# Altium schematic sheet RadationTestBoardMCU.SchDoc
size B; SheetNumber: 12; SheetTotal: 14
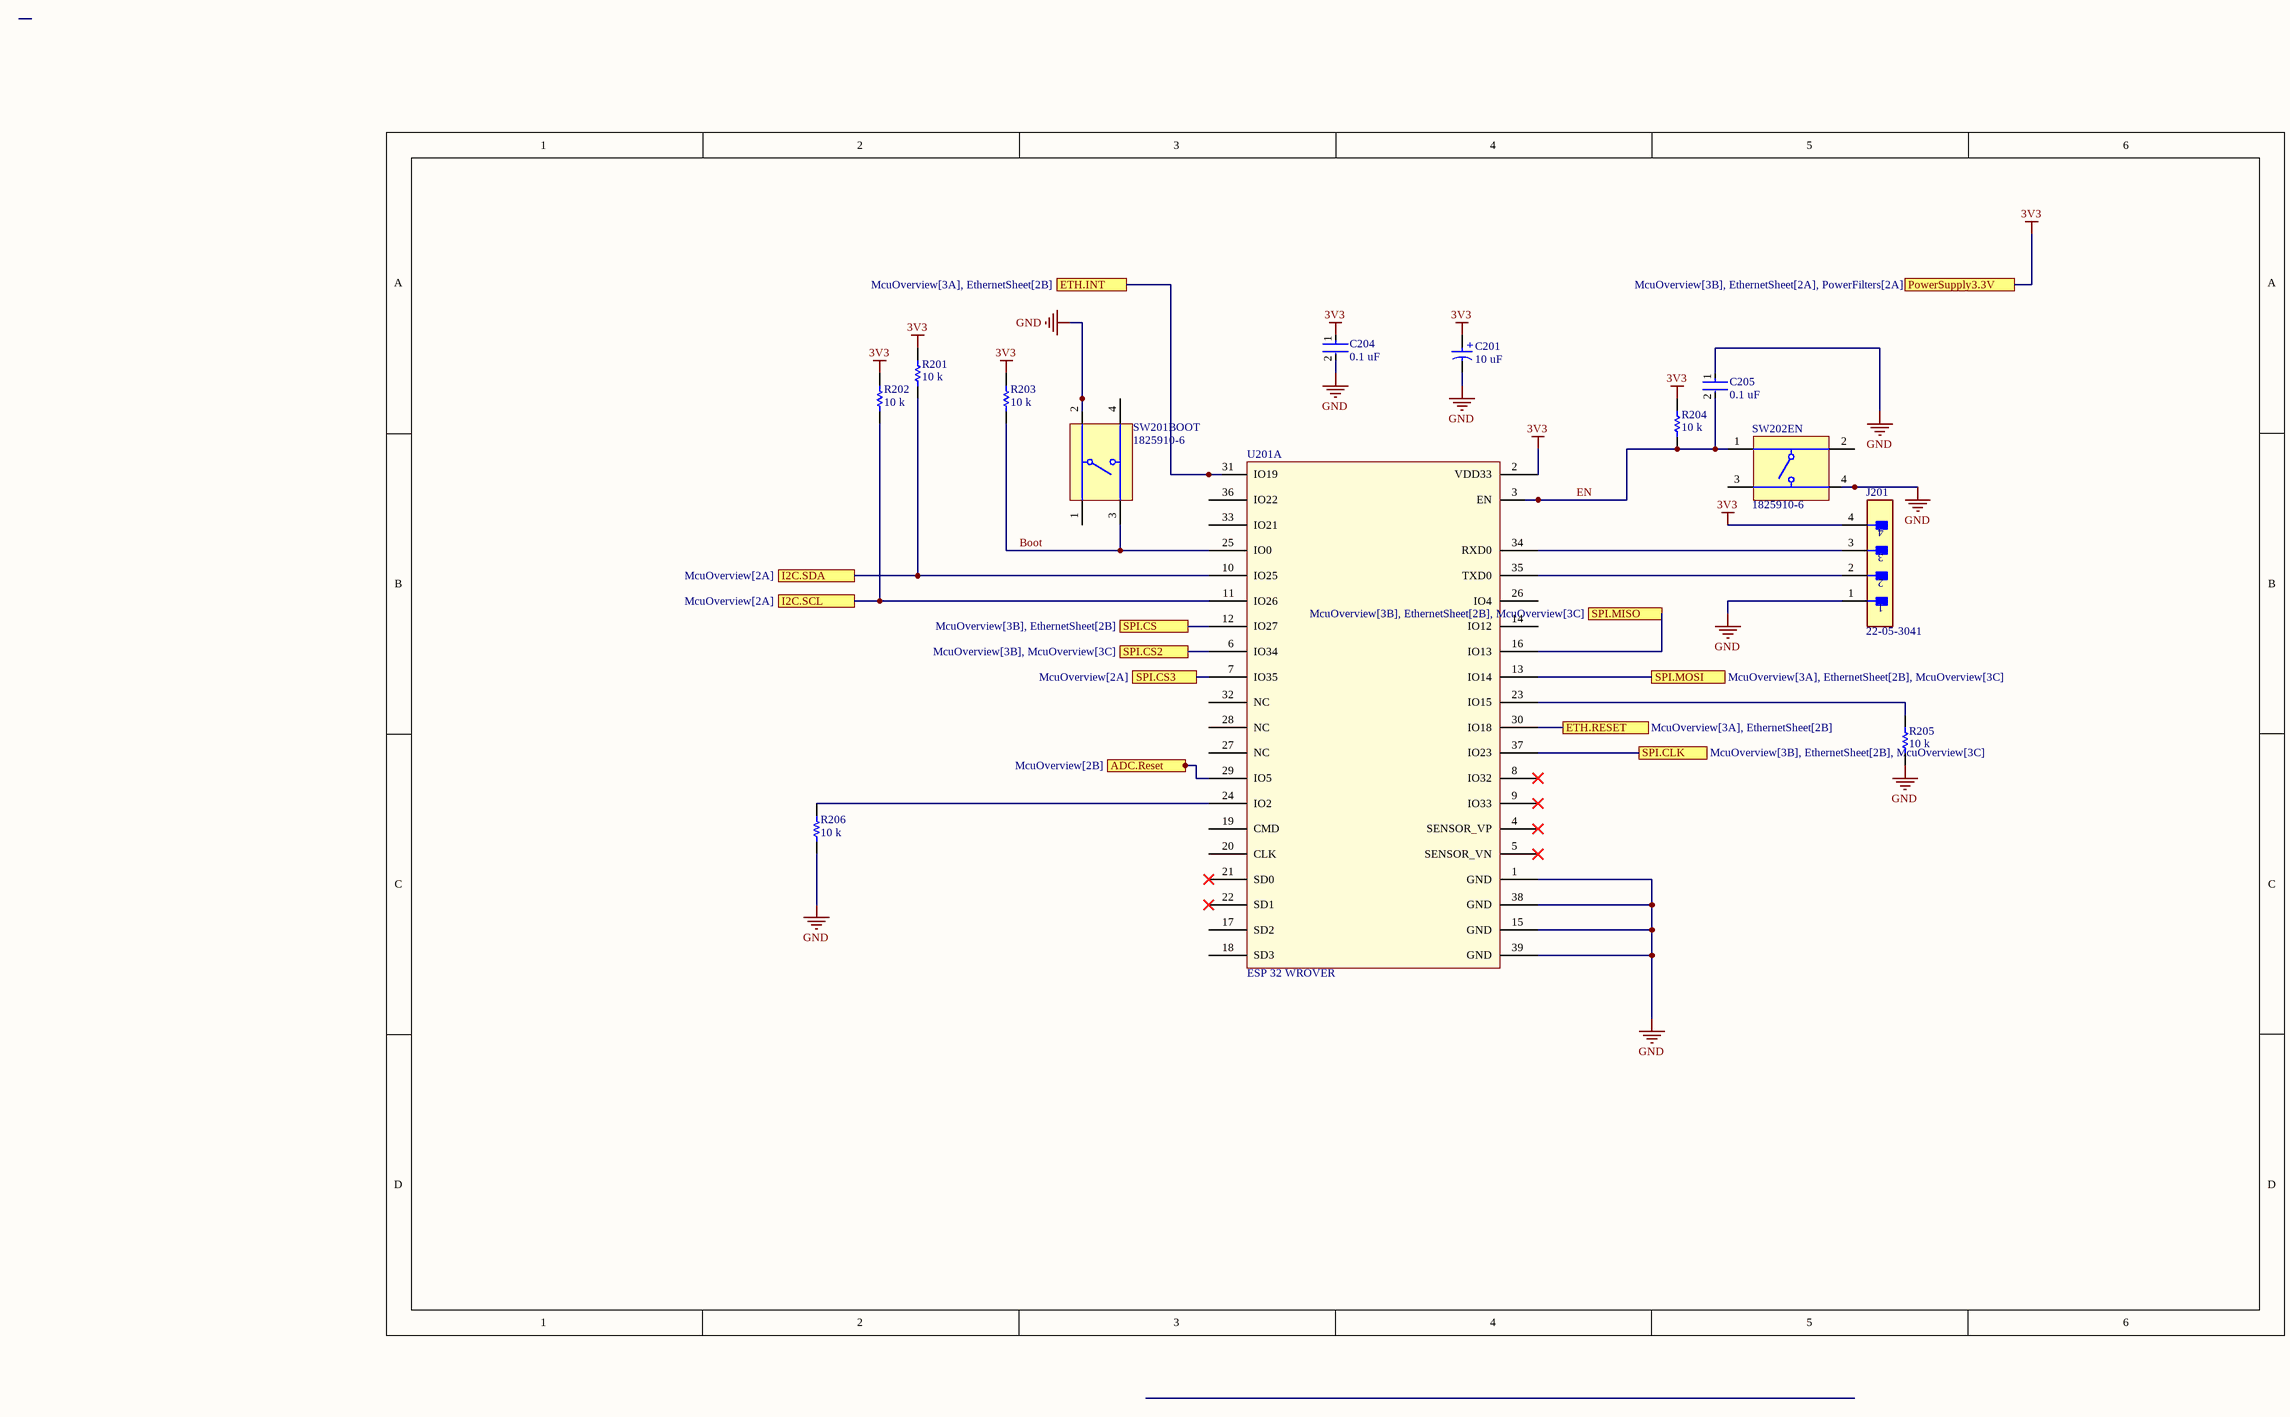
[diagram p0: RadationTestBoardMCU.SchDoc]

## Parts
C201  10 uF  [WCAP-HTG5_D6.3H8]
C204  0.1 uF  [FP-CC0603-DA-IPC_A]
C205  0.1 uF  [FP-CC0603-DA-IPC_A]
J201  22-05-3041  [FP-22-05-3041-MFG]
R201  10 k  [RESC2013X60X35NL10T20]
R202  10 k  [RESC2013X60X35NL10T20]
R203  10 k  [RESC2013X60X35NL10T20]
R204  10 k  [RESC2013X60X35NL10T20]
R205  10 k  [RESC2013X60X35NL10T20]
R206  10 k  [RESC2013X60X35NL10T20]
SW201BOOT  1825910-6  [TECO-1825910-6_V]
SW202EN  1825910-6  [TECO-1825910-6_V]
U201  ESP 32 WROVER  [PCBComponent_1]  (part A of 2)

## Ports
ADC.Reset (see McuOverview[2B]), ETH.INT (see McuOverview[3A], EthernetSheet[2B]), ETH.RESET (see McuOverview[3A], EthernetSheet[2B]), I2C.SCL (see McuOverview[2A]), I2C.SDA (see McuOverview[2A]), PowerSupply3.3V (see McuOverview[3B], EthernetSheet[2A], PowerFilters[2A]), SPI.CLK (see McuOverview[3B], EthernetSheet[2B], McuOverview[3C]), SPI.CS2 (see McuOverview[3B], McuOverview[3C]), SPI.CS3 (see McuOverview[2A]), SPI.CS (see McuOverview[3B], EthernetSheet[2B]), SPI.MISO (see McuOverview[3B], EthernetSheet[2B], McuOverview[3C]), SPI.MOSI (see McuOverview[3A], EthernetSheet[2B], McuOverview[3C])

## Nets
3V3: C201.1(P) C204.1 J201.4 R201.2 R202.2 R203.2 R204.2 U201.2(VDD33) ; port PowerSupply3.3V
GND: C201.2(N) C204.2 C205.1 J201.1 R205.1 R206.1 SW201BOOT.2 SW202EN.4 U201.1(GND) U201.15(GND) U201.38(GND) U201.39(GND)
ADC.Reset: U201.29(IO5) ; port ADC.Reset
Boot: R203.1 SW201BOOT.3 U201.25(IO0)
EN: C205.2 R204.1 SW202EN.1 U201.3(EN)
ETH.INT: U201.31(IO19) ; port ETH.INT
ETH.RESET: U201.30(IO18) ; port ETH.RESET
I2C.SCL: R202.1 U201.11(IO26) ; port I2C.SCL
I2C.SDA: R201.1 U201.10(IO25) ; port I2C.SDA
SPI.CLK: U201.37(IO23) ; port SPI.CLK
SPI.CS: U201.12(IO27) ; port SPI.CS
SPI.CS2: U201.6(IO34) ; port SPI.CS2
SPI.CS3: U201.7(IO35) ; port SPI.CS3
SPI.MISO: U201.16(IO13) ; port SPI.MISO
SPI.MOSI: U201.13(IO14) ; port SPI.MOSI
NetJ201_2: J201.2 U201.35(TXD0)
NetJ201_3: J201.3 U201.34(RXD0)
NetR205_2: R205.2 U201.23(IO15)
NetR206_2: R206.2 U201.24(IO2)

Not connected (* = marked no-connect by the designer): SW201BOOT 1 4; SW202EN 2 3; U201 4(SENSOR_VP)* 5(SENSOR_VN)* 8(IO32)* 9(IO33)* 14(IO12) 17(SD2) 18(SD3) 19(CMD) 20(CLK) 21(SD0)* 22(SD1)* 26(IO4) 27(NC) 28(NC) 32(NC) 33(IO21) 36(IO22)

## Notes on the sheet
- (in symbol CMP-03913-134709123-1) +

## Library data of the parts
C201 = CMP-03913-134709123-1: 870575873001 Cap, 10Uf, 63V, Alu Elec, Hybrid, Rad Rohs Compliant: Yes 870575873001; Capacitance: 10µF; Pitch: 2.5mm; Hole Diameter: 900µm; ESR (Equivalent Series Resistance): 100mΩ; Leakage Current: 6.3µA; Ripple Current: 1.06A; NexarPartId: 134709123; Diameter: 6.3mm; Length: 8mm; Voltage Rating: 63V; Max Operating Temperature: 105°C; Min Operating Temperature: -55°C; RoHS: Compliant
C204 C205 = CMP-03422-001490-1: CAP CER 0.1UF 50V X7R 0603 CC0603JRX7R9BB104; Capacitance: 100nF; Tolerance: 5%; Number of Pins: 2; Depth: 0.8mm; Weight: 7.1E-05oz; Radiation Hardening: No; Case Code (Metric): 1608; Dielectric: X7R; Max Operating Temperature: 125°C; Voltage Rating (DC): 50V; Case/Package: 0603; Halogen Free: Halogen Free; Mount: Surface Mount; Lead Free: Lead Free; Termination: SMD/SMT; RoHS Compliant: Yes; Length: 1.6mm; Series: CC; Resistor Type: Ceramic; Case Code (Imperial): 0603; Construction: Flat; Width: 0.031inch; Height: 0.8mm; Voltage Rating: 50V; Min Operating Temperature: -55°C; Thickness: 0.035inch; Packaging: Tape and Reel
J201 = CMP-2000-05533-2: CONN HEADER R/A 4POS 2.54MM; Manufacturer: Molex; Current Rating: 4A; Conn Gender: Male; Number Of Contacts: 4; Conn Orientation: Right Angle; Voltage Rating: 500V; Number Of Rows: 1; Contact Material: Tin,Nickel; Temperature Range Low: -40°C; ComponentLink2Description: Datasheet; Automotive: No; Lead Free: Yes; ComponentLink2URL: https://www.molex.com/webdocs/datasheets/pdf/en-us/0022053041_PCB_HEADERS.pdf; Octopart: https://octopart.com/22-05-3041-molex-2579; Temperature: -40°C to +80°C; Height: 6.6mm; Device Class L3: unset; Temperature Range High: +80°C; Pitch: 2.54mm; Manufacturer Part Number: 22-05-3041; Device Class L2: Headers and Wire Housings; RoHS: TRUE; Footprint Url: https://www.molex.com/pdm_docs/sd/022053041_sd.pdf; Category: Conn; Digikey Description: CONN HEADER R/A 4POS 2.54MM; Device Class L1: Connectors; Package: 0
R201-R206 = CMP-1659-00013-4: Chip Resistor, 10 KOhm, +/- 1%, 0.125 W, -55 to 155 degC, 0805 (2012 Metric), RoHS, Tape and Reel RC0805FR-0710KL; Manufacturer: Yageo; Voltage Rating: 150 V; Mount: Surface Mount; ComponentLink1Description: Manufacturer URL; ComponentLink2URL: http://www.yageo.com/documents/recent/PYu-RC_Group_51_RoHS_L_04.pdf; Pins: 2; Length: 2 mm; Min Operating Temperature: -55 degC; Height: 0.5 mm; Mounting Technology: Surface Mount; RoHSCompliant: true; REACH SVHC: No SVHC; ComponentLink1URL: http://www.yageo.com/; Max Operating Temperature: 155 degC; PackageReference: 0805; DatasheetVersion: Rev. 4, 02/2016; Package Quantity: 5000; Packaging: Tape and Reel; ComponentLink2Description: Datasheet; PackageDescription: 2-Pin Surface Mounted Device, Body 2 x 1.25 mm
SW201BOOT SW202EN = CMP-1684-00021-1: Tact Switch, SPST-NO, 0.05 A, -35 to 85 degC, 4-Pin THD, RoHS, Bulk; Manufacturer: TE Connectivity; Maximum Contact Resistance: 100mOhm; Mechanical Life: 100000Cycles; Bushing Type: Unthreaded; Switch Configuration: OFF(ON); Maximum DC Voltage Rating: 24V; Contact Rating @ Voltage: 0.05A@24VDC; Actuator Color: Black; Body Orientation: Straight; Function: MomentaryContact; Illumination: N/R; Actuator Style: RoundButton; Actuator Material: PolybutyleneTerephthalate; Dielectric Strength: 500VAC; Pole Throw Configuration: SPST; Actuator Length: 1.4mm; Product Weight: N/A; Contact Material: CopperAlloy; Housing Material: N/A; Terminal Type: PCPins; Minimum Insulation Resistance: 100MOhm; Package Description: 4-Pin Through Hole Device, Body 5.99 x 5.99 mm, Pitch 6.5 mm; Part No: 1825910-6; Package Reference: THD; Base Material: N/A; Manufacturer URL: http://www.te.com; Contact Plating: Silver; RoHS: Yes; Datasheet Version: Rev. C9; Electrical Life: 100000Cycles; Maximum AC Voltage Rating: N/A; Thread Size: N/R; Operating Temperature: -35to85C; Mounting: ThroughHole; Dimension: 5.99x5mm; Datasheet URL: http://www.te.com/commerce/DocumentDelivery/DDEController?Action=showdoc&DocId=Customer+Drawing%7F1825910%7FC9%7Fpdf%7FEnglish%7FENG_CD_1825910_C9.pdf%7F1825910-6; Family: 1825910; Seal Location: N/A; Seal Description: N/A; Packaging: N/A